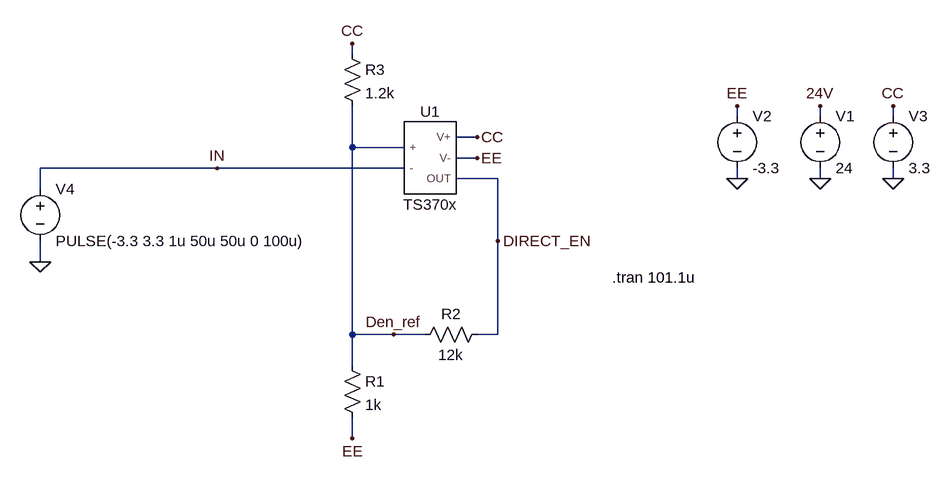
[diagram p0: schematic schmitt_trigger.asc]
schmitt_trigger.asc, the LTspice schematic file:
Version 4.1
SHEET 1 880 680
WIRE -208 -144 -208 -160
WIRE 384 -48 384 -64
WIRE 512 -48 512 -64
WIRE 624 -48 624 -64
WIRE -16 -16 -48 -16
WIRE -208 0 -208 -64
WIRE -128 0 -208 0
WIRE -16 16 -48 16
WIRE -416 32 -688 32
WIRE -128 32 -416 32
WIRE 16 48 -48 48
WIRE 384 48 384 32
WIRE 512 48 512 32
WIRE 624 48 624 32
WIRE -688 64 -688 32
WIRE 16 144 16 48
WIRE -688 176 -688 144
WIRE -208 288 -208 0
WIRE -144 288 -208 288
WIRE -96 288 -144 288
WIRE 16 288 16 144
WIRE 16 288 -16 288
WIRE -208 336 -208 288
WIRE -208 448 -208 416
FLAG 16 144 DIRECT_EN
FLAG -144 288 Den_ref
FLAG -208 -160 CC
FLAG -16 -16 CC
FLAG -16 16 EE
FLAG -208 448 EE
FLAG 384 48 0
FLAG 624 -64 CC
FLAG 624 48 0
FLAG 384 -64 EE
FLAG 512 -64 24V
FLAG 512 48 0
FLAG -688 176 0
FLAG -416 32 IN
SYMBOL res -224 320 R0
SYMATTR InstName R1
SYMATTR Value 1k
SYMATTR SpiceLine tol=5
SYMBOL res 0 272 R90
WINDOW 0 0 56 VBottom 2
WINDOW 3 32 56 VTop 2
SYMATTR InstName R2
SYMATTR Value 12k
SYMATTR SpiceLine tol=5
SYMBOL res -224 -160 R0
SYMATTR InstName R3
SYMATTR Value 1.2k
SYMATTR SpiceLine tol=2
SYMBOL voltage 512 -64 R0
WINDOW 123 0 0 Left 0
WINDOW 39 0 0 Left 0
SYMATTR InstName V1
SYMATTR Value 24
SYMBOL voltage 384 -64 R0
WINDOW 123 0 0 Left 0
WINDOW 39 0 0 Left 0
SYMATTR InstName V2
SYMATTR Value -3.3
SYMBOL voltage 624 -64 R0
SYMATTR InstName V3
SYMATTR Value 3.3
SYMBOL voltage -688 48 R0
WINDOW 123 0 0 Left 0
WINDOW 39 0 0 Left 0
SYMATTR InstName V4
SYMATTR Value PULSE(-3.3 3.3 1u 50u 50u 0 100u)
SYMBOL TS370x -96 16 R0
SYMATTR InstName U1
TEXT 192 200 Left 2 !.tran 101.1u

The netlist it stands for:
* schmitt_trigger.asc
R1 Den_ref EE 1k tol=5
R2 DIRECT_EN Den_ref 12k tol=5
R3 CC Den_ref 1.2k tol=2
V1 24V 0 24
V2 EE 0 -3.3
V3 CC 0 3.3
V4 IN 0 PULSE(-3.3 3.3 1u 50u 50u 0 100u)
X§U1 Den_ref IN CC EE DIRECT_EN TS370x  ; pins + - V+ V- OUT
.tran 101.1u
.lib ".\libraries\ts370x_spice.lib"
.backanno
.end